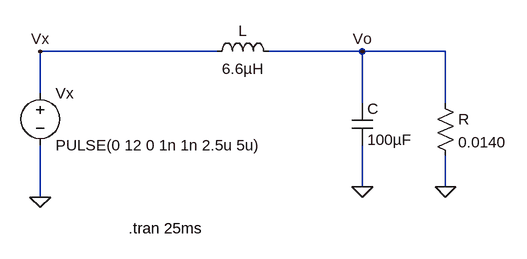
[diagram p0: schematic RLC Circuit.asc]
RLC Circuit.asc, the LTspice schematic file:
Version 4
SHEET 1 880 680
WIRE 144 144 -128 144
WIRE 368 144 224 144
WIRE 496 144 368 144
WIRE -128 208 -128 144
WIRE 368 224 368 144
WIRE 496 224 496 144
WIRE 368 352 368 288
WIRE 496 352 496 304
WIRE -128 368 -128 288
FLAG 368 352 0
FLAG 496 352 0
FLAG -128 368 0
FLAG -128 144 Vx
FLAG 368 144 Vo
SYMBOL ind 128 160 R270
WINDOW 0 32 56 VTop 2
WINDOW 3 5 56 VBottom 2
SYMATTR InstName L
SYMATTR Value 6.6µH
SYMBOL cap 352 224 R0
SYMATTR InstName C
SYMATTR Value 100µF
SYMBOL res 480 208 R0
SYMATTR InstName R
SYMATTR Value 0.0140
SYMBOL voltage -128 192 R0
WINDOW 123 0 0 Left 0
WINDOW 39 0 0 Left 0
SYMATTR InstName Vx
SYMATTR Value PULSE(0 12 0 1n 1n 2.5u 5u)
TEXT 8 416 Left 2 !.tran 25ms

The netlist it stands for:
* RLC Circuit.asc
L Vx Vo 6.6µH
C Vo 0 100µF
R Vo 0 0.0140
Vx Vx 0 PULSE(0 12 0 1n 1n 2.5u 5u)
.tran 25ms
.backanno
.end